# EAGLE schematic esquematico_projeto-integrado2TRI (EAGLE 9.6.2)
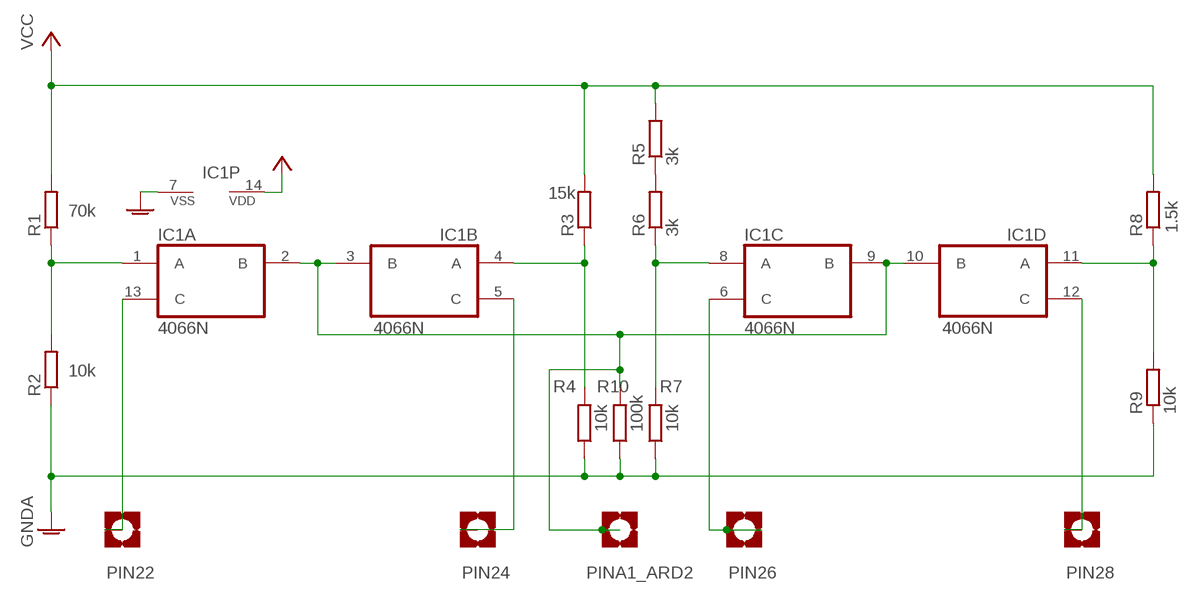
[diagram p0: schematic, sheet 1]

## Parts
IC1  4066N  [DIL14]
PIN22  MOUNT-PAD-SQUARE2.8  [2,8-PAD-SQUARE]
PIN24  MOUNT-PAD-SQUARE2.8  [2,8-PAD-SQUARE]
PIN26  MOUNT-PAD-SQUARE2.8  [2,8-PAD-SQUARE]
PIN28  MOUNT-PAD-SQUARE2.8  [2,8-PAD-SQUARE]
PINA1_ARD2  MOUNT-PAD-SQUARE2.8  [2,8-PAD-SQUARE]
R1  70k  R-EU_0309/10  [0309/10]
R2  10k  R-EU_0309/10  [0309/10]
R3  15k  R-EU_0309/10  [0309/10]
R4  10k  R-EU_0309/10  [0309/10]
R5  3k  R-EU_0309/10  [0309/10]
R6  3k  R-EU_0309/10  [0309/10]
R7  10k  R-EU_0309/10  [0309/10]
R8  1.5k  R-EU_0309/10  [0309/10]
R9  10k  R-EU_0309/10  [0309/10]
R10  100k  R-EU_0309/10  [0309/10]

## Nets
GNDA: IC1.7(P:VSS) R2.1 R4.1 R7.1 R9.1 R10.1
N$1: IC1.1(A:A) R1.1 R2.2
N$2: IC1.4(B:A) R3.1 R4.2
N$4: IC1.8(C:A) R6.1 R7.2
N$6: IC1.11(D:A) R8.1 R9.2
N$7: IC1.6(C:C) PIN26.B2,8(MOUNT)
N$10: R5.1 R6.2
PIN22: IC1.13(A:C) PIN22.B2,8(MOUNT)
PIN24: IC1.5(B:C) PIN24.B2,8(MOUNT)
PIN28: IC1.12(D:C) PIN28.B2,8(MOUNT)
SAÍDA: IC1.2(A:B) IC1.3(B:B) IC1.9(C:B) IC1.10(D:B) PINA1_ARD2.B2,8(MOUNT) R10.2
VCC: IC1.14(P:VDD) R1.2 R3.2 R5.2 R8.2

## Library data of the parts
IC1 = 40xx:4066: Quad bilateral ANALOG SWITCH; SPICEPREFIX: J
PIN22 PIN24 PIN26 PIN28 PINA1_ARD2 = holes:MOUNT-PAD-SQUARE: MOUNTING PAD, square
R1-R10 = rcl:R-EU_: RESISTOR, European symbol; SPICEPREFIX: R